# EAGLE design Camera-IR-RC-v4 (EAGLE 5.07)
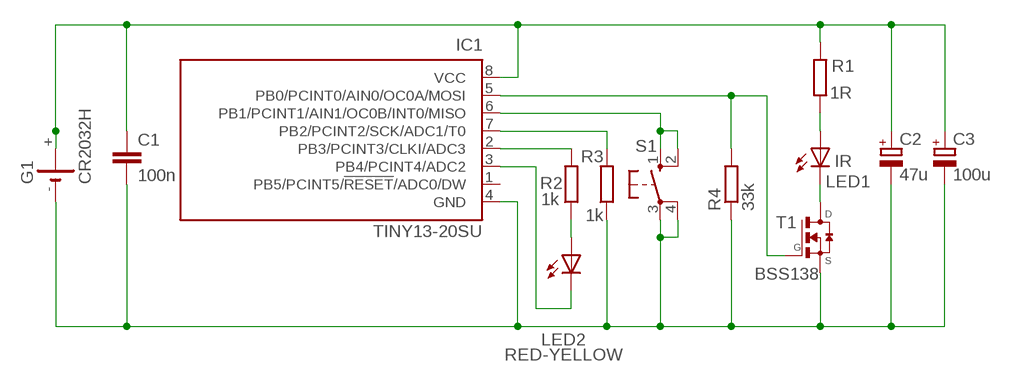
[diagram p0: schematic, sheet 1]

## Parts
C1  100n  C-EUC0805  [C0805]
C2  47u  CPOL-EUSMCD  [SMC_D]
C3  100u  CPOL-EUSMCB  [SMC_B]
G1  CR2032H  [CR2032H]
IC1  TINY13-20SU  [8S2]
LED1  IR  LED3MM  [LED3MM]
LED2  RED-YELLOW  LED3MM  [LED3MM]
R1  1R  R-EU_R0805  [R0805]
R2  1k  R-EU_R0805  [R0805]
R3  1k  R-EU_R0805  [R0805]
R4  33k  R-EU_R0805  [R0805]
S1  10-XX  [B3F-10XX]
T1  BSS138  [SOT23]

## Nets
GND: C1.2 C2.- C3.- G1.- IC1.4(GND) R3.1 R4.1 S1.3(P) S1.4(P1) T1.2(S)
N$1: LED1.K(C) T1.3(D)
N$2: IC1.7(PB2/PCINT2/SCK/ADC1/T0) R3.2
N$3: LED1.A R1.1
N$4: IC1.5(PB0/PCINT0/AIN0/OC0A/MOSI) R4.2 T1.1(G)
N$5: IC1.3(PB4/PCINT4/ADC2) LED2.K(C)
N$6: IC1.2(PB3/PCINT3/CLKI/ADC3) R2.2
N$7: IC1.6(PB1/PCINT1/AIN1/OC0B/INT0/MISO) S1.1(S) S1.2(S1)
N$9: LED2.A R2.1
VCC: C1.1 C2.+ C3.+ G1.+ G1.+@1(+) IC1.8(VCC) R1.2
Unconnected: IC1.1(PB5/PCINT5/!RESET!/ADC0/DW)

## Library data of the parts
C1 = rcl:C-EU: CAPACITOR, European symbol
C2 C3 = rcl:CPOL-EU: POLARIZED CAPACITOR, European symbol
G1 = battery1:CR2032H: LI BATTERY Varta
IC1 = atmel:TINY13: 8-bit AVR Microcontroller with 1K Bytes In-System Programmable Flash Source: http://www.atmel.com/dyn/resources/prod_documents/2535S.pdf
LED1 LED2 = led:LED: LED OSRAM: - CHIPLED LG R971, LG N971, LY N971, LG Q971, LY Q971, LO R971, LY R971 LH N974, LH R974 LS Q976, LO Q976, LY Q976 LO Q996 - Hyper CHIPLED LW Q18S LB Q993, LB Q99A, LB R99A - SideLED LS A670, LO A670, LY A670, LG A670, LP A670 LB A673, LV A673, LT A673, LW A673 LH A674 LY A675 LS A676, LA A676, LO A676, LY A676, LW A676 LS A679, LY A679, LG A679 - Hyper Micro SIDELED® LS Y876, LA Y876, LO Y876, LY Y876 LT Y87S - SmartLED LW L88C, LW L88S LB L89C, LB L89S, LG L890 LS L89K, LO L89K, LY L89K LS L896, LA L896, LO L896, LY L896 - TOPLED LS T670, LO T670, LY T670, LG T670, LP T670 LSG T670, LSP T670, LSY T670, LOP T670, LYG T670 LG T671, LOG T671, LSG T671 LB T673, LV T673, LT T673, LW T673 LH T674 LS T676, LA T676, LO T676, LY T676, LB T676, LH T676, LSB T676, LW T676 LB T67C, LV T67C, LT T67C, LS T67K, LO T67K, LY T67K, LW E67C LS E67B, LA E67B, LO E67B, LY E67B, LB E67C, LV E67C, LT E67C LW T67C LS T679, LY T679, LG T679 LS T770, LO T770, LY T770, LG T770, LP T770 LB T773, LV T773, LT T773, LW T773 LH T774 LS E675, LA E675, LY E675, LS T675 LS T776, LA T776, LO T776, LY T776, LB T776 LHGB T686 LT T68C, LB T68C - Hyper Mini TOPLED® LB M676 - Mini TOPLED Santana® LG M470 LS M47K, LO M47K, LY M47K Source: http://www.osram.convergy.de LUXEON: - LUMILED® LXK2-PW12-R00, LXK2-PW12-S00, LXK2-PW14-U00, LXK2-PW14-V00 LXK2-PM12-R00, LXK2-PM12-S00, LXK2-PM14-U00 LXK2-PE12-Q00, LXK2-PE12-R00, LXK2-PE12-S00, LXK2-PE14-T00, LXK2-PE14-U00 LXK2-PB12-K00, LXK2-PB12-L00, LXK2-PB12-M00, LXK2-PB14-N00, LXK2-PB14-P00, LXK2-PB14-Q00 LXK2-PR12-L00, LXK2-PR12-M00, LXK2-PR14-Q00, LXK2-PR14-R00 LXK2-PD12-Q00, LXK2-PD12-R00, LXK2-PD12-S00 LXK2-PH12-R00, LXK2-PH12-S00 LXK2-PL12-P00, LXK2-PL12-Q00, LXK2-PL12-R00 Source: www.luxeon.com KINGBRIGHT: KA-3528ASYC Source: www.kingbright.com
R1-R4 = rcl:R-EU_: RESISTOR, European symbol
S1 = switch-omron:10-XX: OMRON SWITCH
T1 = transistor-fet:BSS138*: Power MOSFET

## Board
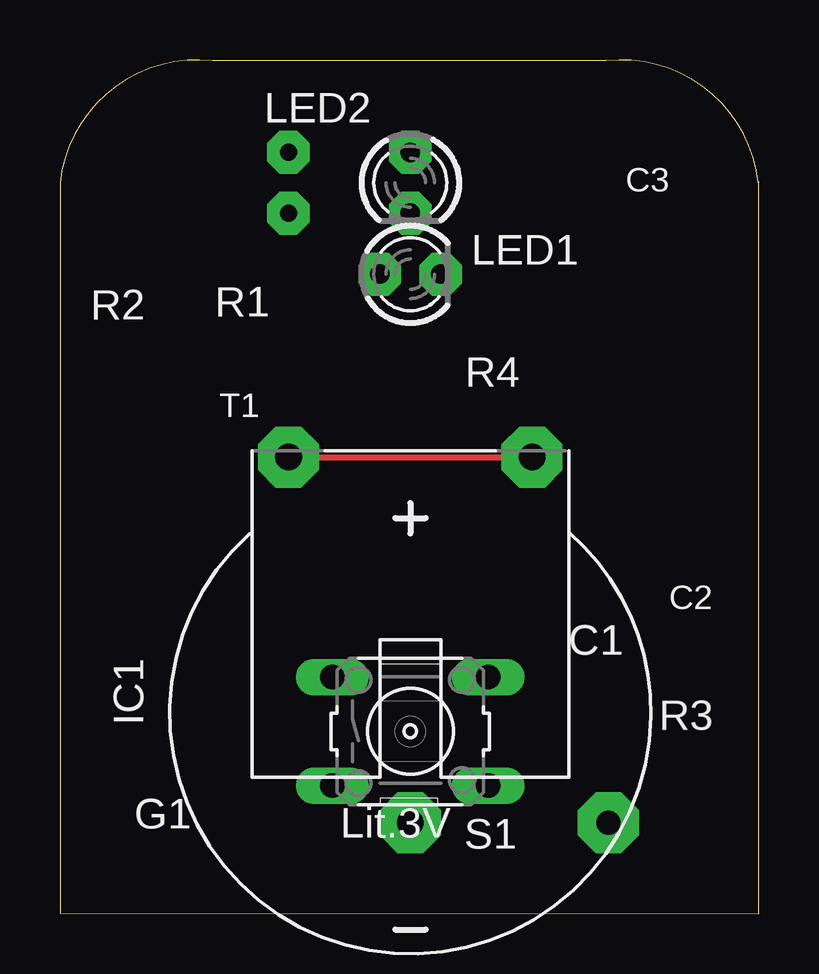
[diagram p1: board, top side]
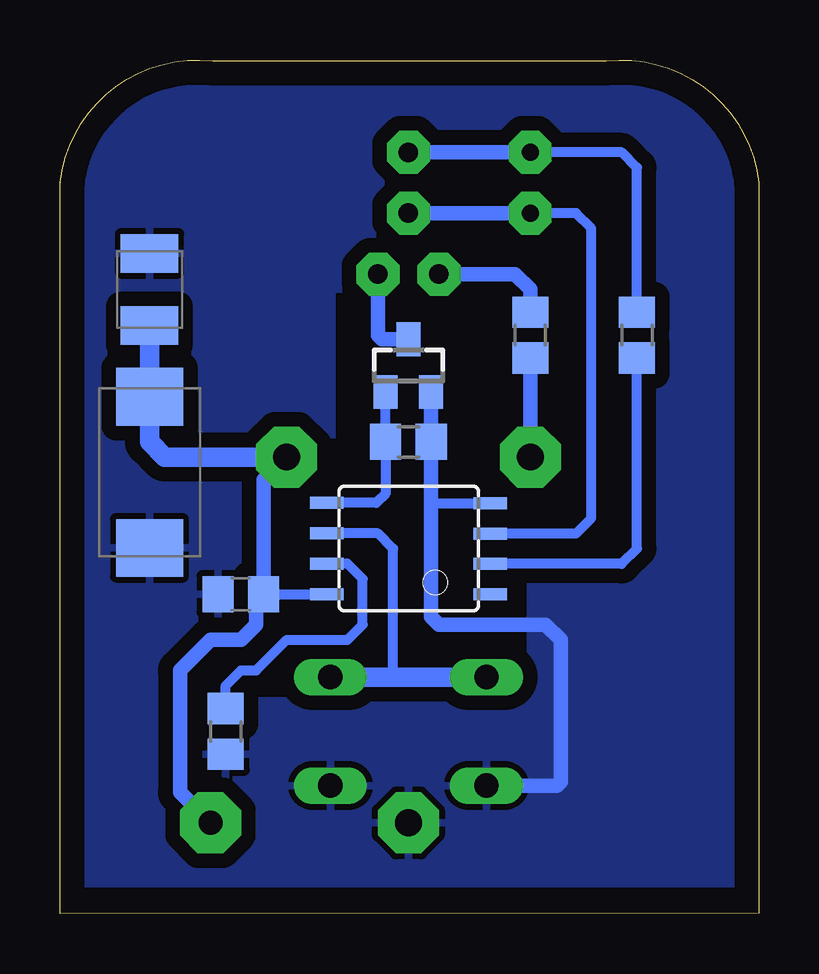
[diagram p2: board, bottom side, seen from below]

Size 29.13 x 35.57 mm. Coordinates in mm from the lower left corner, seen from the top.
Outline: 0,0.03 29.13,0 29.13,30.47 29.12,30.45 arc90 22.77,35.53 6.36,35.53 arc90 0,30.44 0,0.03
Copper layers (1*16): Top 0.035mm / dielectric 1.5mm / Bottom 0.035mm
Design rules "default *": minimum track width 10mil, minimum drill 24mil, track to track 8mil, track to pad 8mil, pad to pad 8mil, via to via 8mil, smd to smd 8mil, copper to edge 40mil, drill to drill 8mil, minimum pad ring 10mil, minimum via ring 8mil, stop-mask expansion 4mil, vias tented up to drill 0mil, thermal gap 10mil

### Footprints (pad centres in the part's own frame; a part is rotated, then mirrored left to right if it is on the bottom)
C0805 = smd 1.3 x 1.5: 1 -0.95,0; 2 0.95,0
SMC_D = smd 2.4 x 2.8: + -3.15,0; - 3.15,0
SMC_B = smd 1.6 x 2.4: + -1.5,0; - 1.5,0
CR2032H = drill 1.118 pad 2.54 octagon: + 5.08,10.795; +@1 -5.08,10.795; - 0,-4.445
8S2 = smd 0.5 x 1.4: 1 -1.905,-3.404; 2 -0.645,-3.404; 3 0.625,-3.404; 4 1.895,-3.404; 5 1.905,3.404; 6 0.635,3.404; 7 -0.635,3.404; 8 -1.905,3.404
LED3MM = drill 0.813 pad 1.778 octagon: A -1.27,0; K 1.27,0
R0805 = smd 1.3 x 1.5: 1 -0.95,0; 2 0.95,0
B3F-10XX = drill 1.016 long: 1 -3.251,2.261; 2 3.251,2.261; 3 -3.251,-2.261; 4 3.251,-2.261
SOT23@1 = smd 1 x 1.4: 1 -0.95,-1.1; 2 0.95,-1.1; 3 0,1.1

### Placement (x,y rotation side)
C1  21.59,13.31 180 bottom
C2  25.4,18.39 270 bottom
C3  25.4,26.01 90 bottom
G1  14.61,8.23 0 top
IC1  14.61,15.21 90 bottom
LED1  14.61,26.64 0 top
LED2  14.61,30.45 270 top
R1  9.53,24.1 270 bottom
R2  5.08,24.1 270 bottom
R3  22.23,7.59 90 bottom
R4  14.61,19.66 180 bottom
S1  14.61,7.59 0 top
T1  BSS138  [SOT23@1]  14.61,22.83 0 bottom

### Tracks (layer width: path | path; a pad name or v marks a point on that pad's centre or on a via)
GND
  Bottom 0.406: R4.1 | IC1.4 13.65,17.11 13.66,17.12
  Bottom 0.61: R4.1 T1.2 | R4.1 13.66,17.12 13.66,12.37 13.34,12.04 8.89,12.04 8.26,11.4 8.26,5.49 8.41,5.33 S1.3
  pour Bottom (isolate 0.61): 0,1.24 29.21,1.24 29.18,11.13 29.16,11.15 29.16,11.76 22.23,11.73 22.23,8.86 9.53,8.86 9.53,26.01 17.78,26.01 17.78,12.04 29.21,12.04 29.21,35.53 0,35.53
N$1
  Bottom 0.61: T1.3 15.71,23.93 15.88,24.1 LED1.K
N$2
  Bottom 0.406: IC1.7 17.14,14.58 16.51,13.94 16.51,12.04 17.14,11.4 19.68,11.4 20.95,10.13 21.59,10.13 22.23,9.5 R3.2
N$3
  Bottom 0.61: R1.1 9.53,26.01 10.16,26.64 LED1.A
N$4
  Bottom 0.406: T1.1 R4.2 15.54,17.53 15.95,17.12 IC1.5
N$5  (via drill 0.7 pad 1.78)
  Bottom 0.406: v9.53,29.18 7.62,29.18 6.99,28.55 6.99,16.48 7.63,15.84 IC1.3
  Bottom 0.61: v9.53,29.18 LED2.K
N$6
  Bottom 0.406: IC1.2 5.72,14.57 5.08,15.21 R2.2
N$7
  Bottom 0.406: 15.24,9.86 15.24,15.21 15.88,15.85 IC1.6
  Bottom 0.813: S1.1 15.24,9.86 S1.2
N$9  (via drill 0.7 pad 1.78)
  Bottom 0.406: R2.1 5.08,31.09 5.71,31.72 v9.53,31.72
  Bottom 0.61: v9.53,31.72 LED2.A
VCC  (via drill 1 pad 2.54)
  Top 0.254: G1.+@1 G1.+
  Bottom 0.406: C1.1 IC1.8
  Bottom 0.61: G1.+@1 R1.2 | G1.+ 20.64,18.07 C1.1 20.95,12.99 20.95,12.04 21.59,11.4 22.86,11.4 24.13,10.13 24.13,5.05 v22.86,3.78
  Bottom 0.813: G1.+ 24.77,19.02 25.4,19.66 C2.+ C3.+